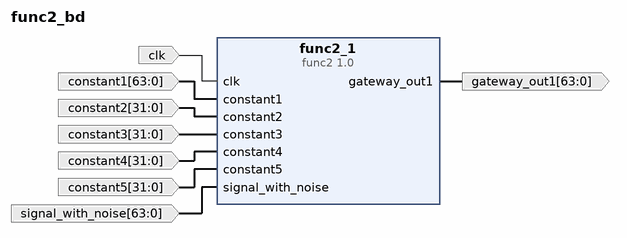
[diagram p0: block diagram of the top level]
# Vivado block design func2_bd, xc7a35tcpg236-1, Vivado 2021.1
create_bd_design func2_bd

create_bd_port -dir I -type clk clk
create_bd_port -dir I -from 63 -to 0 -type data constant1
create_bd_port -dir I -from 31 -to 0 -type data constant2
create_bd_port -dir I -from 31 -to 0 -type data constant3
create_bd_port -dir I -from 31 -to 0 -type data constant4
create_bd_port -dir I -from 31 -to 0 -type data constant5
create_bd_port -dir O -from 63 -to 0 -type data gateway_out1
create_bd_port -dir I -from 63 -to 0 -type data signal_with_noise

create_bd_cell -type ip -vlnv Xilinx_Competition:SysGen:func2:1.0 func2_1

# ---- connections ----

connect_bd_net [get_bd_ports clk] [get_bd_pins func2_1/clk]
connect_bd_net -net constant1_1 [get_bd_ports constant1] [get_bd_pins func2_1/constant1]
connect_bd_net -net constant2_1 [get_bd_ports constant2] [get_bd_pins func2_1/constant2]
connect_bd_net -net constant3_1 [get_bd_ports constant3] [get_bd_pins func2_1/constant3]
connect_bd_net -net constant4_1 [get_bd_ports constant4] [get_bd_pins func2_1/constant4]
connect_bd_net -net constant5_1 [get_bd_ports constant5] [get_bd_pins func2_1/constant5]
connect_bd_net [get_bd_pins func2_1/gateway_out1] [get_bd_ports gateway_out1]
connect_bd_net [get_bd_ports signal_with_noise] [get_bd_pins func2_1/signal_with_noise]

validate_bd_design
save_bd_design
